# Altium schematic sheet DACs.SchDoc
size A; SheetNumber: 3; SheetTotal: 9
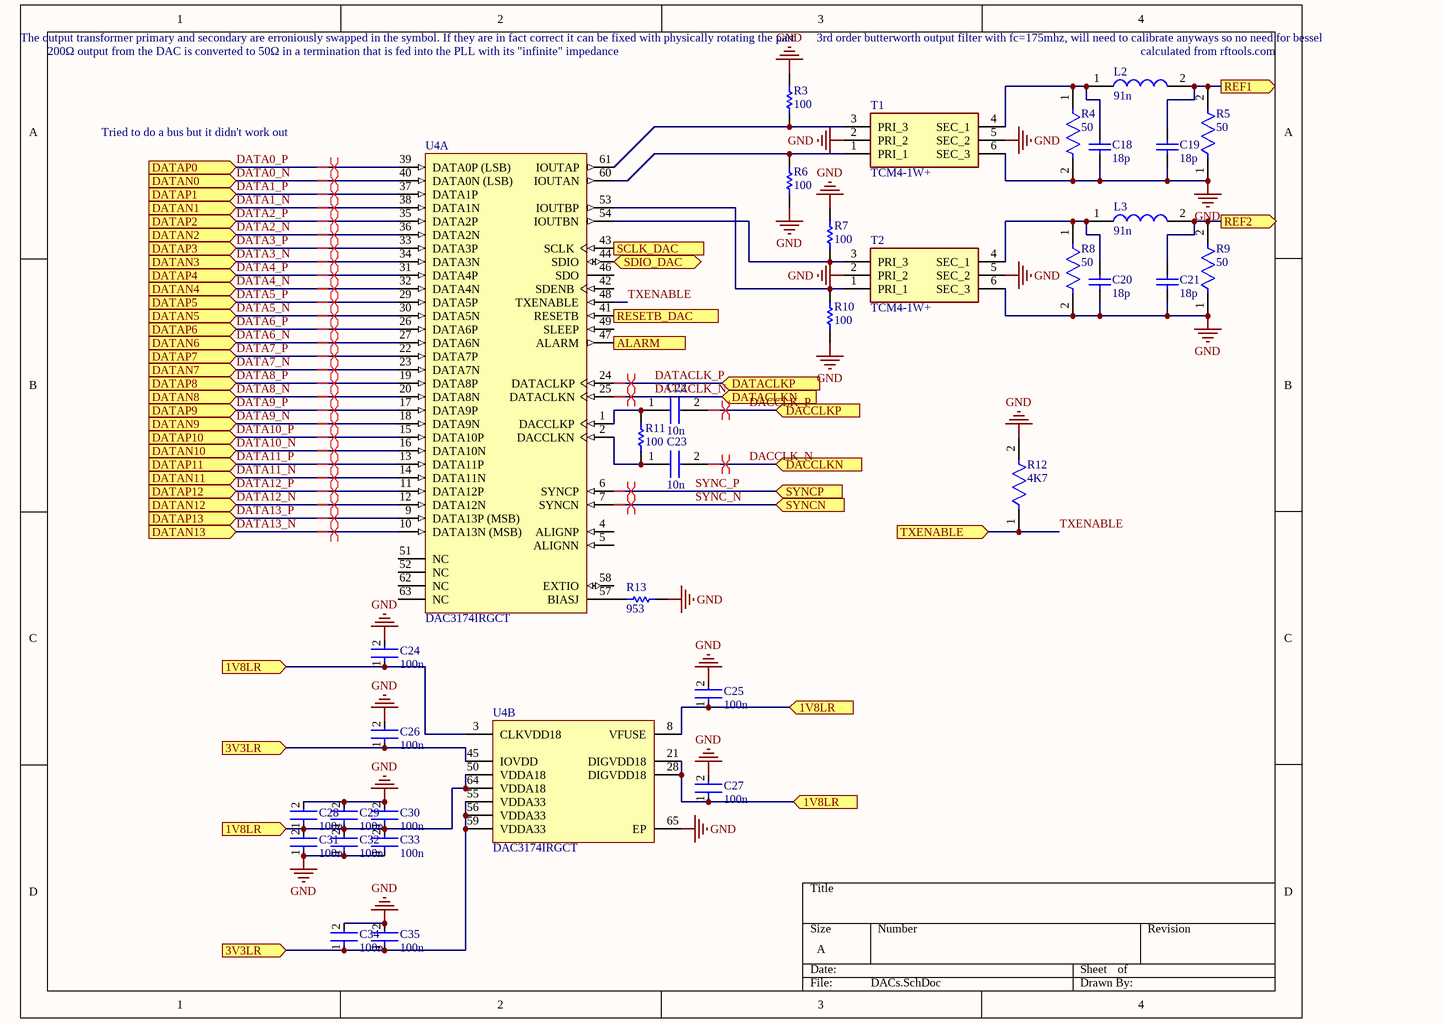
[diagram p0: DACs.SchDoc]

## Parts
C18  18p  [CAPC1006X50X20LL10T10]
C19  18p  [CAPC1006X50X20LL10T10]
C20  18p  [CAPC1006X50X20LL10T10]
C21  18p  [CAPC1006X50X20LL10T10]
C22  10n  [CAPC1005X61N]
C23  10n  [CAPC1005X61N]
C24  100n  [FP-GRM155-0_05-IPC_C]
C25  100n  [FP-GRM155-0_05-IPC_C]
C26  100n  [FP-GRM155-0_05-IPC_C]
C27  100n  [FP-GRM155-0_05-IPC_C]
C28  100n  [FP-GRM155-0_05-IPC_C]
C29  100n  [FP-GRM155-0_05-IPC_C]
C30  100n  [FP-GRM155-0_05-IPC_C]
C31  100n  [FP-GRM155-0_05-IPC_C]
C32  100n  [FP-GRM155-0_05-IPC_C]
C33  100n  [FP-GRM155-0_05-IPC_C]
C34  100n  [FP-GRM155-0_05-IPC_C]
C35  100n  [FP-GRM155-0_05-IPC_C]
L2  91n  [INDC1006X65N]
L3  91n  [INDC1006X65N]
R3  100  [RESC1005X40X25LL05T05]
R4  50  [FP-RC0402-0_4-MFG]
R5  50  [FP-RC0402-0_4-MFG]
R6  100  [RESC1005X40X25LL05T05]
R7  100  [RESC1005X40X25LL05T05]
R8  50  [FP-RC0402-0_4-MFG]
R9  50  [FP-RC0402-0_4-MFG]
R10  100  [RESC1005X40X25LL05T05]
R11  100  [RESC1005X40X25LL05T05]
R12  4K7  [FP-RT0402-MFG]
R13  953  [RESC1005X40X25NL10T10]
T1  TCM4-1W+  [TCM41W]
T2  TCM4-1W+  [TCM41W]
U4  DAC3174IRGCT  [TI-RGC64-7400X7400TP_V]  (parts A,B of 2)

## Ports
1V8LR (in), 3V3LR (in), ALARM (out), DACCLKN (in), DACCLKP (in), DATACLKN (in), DATACLKP (in), DATAN0 (in), DATAN1 (in), DATAN2 (in), DATAN3 (in), DATAN4 (in), DATAN5 (in), DATAN6 (in), DATAN7 (in), DATAN8 (in), DATAN9 (in), DATAN10 (in), DATAN11 (in), DATAN12 (in), DATAN13 (in), DATAP0 (in), DATAP1 (in), DATAP2 (in), DATAP3 (in), DATAP4 (in), DATAP5 (in), DATAP6 (in), DATAP7 (in), DATAP8 (in), DATAP9 (in), DATAP10 (in), DATAP11 (in), DATAP12 (in), DATAP13 (in), REF1 (out), REF2 (out), RESETB_DAC (in), SCLK_DAC (in), SDIO_DAC (bidir), SYNCN (in), SYNCP (in), TXENABLE (in)

## Nets
GND: C18.1 C19.1 C20.1 C21.1 C24.2 C25.2 C26.2 C27.2 C28.2 C29.2 C30.2 C31.1 C32.1 C33.1 C34.2 C35.2 R3.2 R4.2 R5.1 R6.1 R7.2 R8.2 R9.1 R10.1 R12.2 R13.2 T1.2(PRI_2) T1.5(SEC_2) T1.6(SEC_3) T2.2(PRI_2) T2.5(SEC_2) T2.6(SEC_3) U4.65(EP)
1V8LR: C24.1 C25.1 C27.1 C28.1 C29.1 C30.1 C31.2 C32.2 C33.2 U4.3(CLKVDD18) U4.8(VFUSE) U4.21(DIGVDD18) U4.28(DIGVDD18) U4.50(VDDA18) U4.64(VDDA18) ; port 1V8LR
3V3LR: C26.1 C34.1 C35.1 U4.45(IOVDD) U4.55(VDDA33) U4.56(VDDA33) U4.59(VDDA33) ; port 3V3LR
ALARM: U4.47(ALARM) ; port ALARM
DACCLK_N: C23.2 ; port DACCLKN
DACCLK_P: C22.2 ; port DACCLKP
DATA0_N: U4.40(DATA0N_(LSB)) ; port DATAN0
DATA0_P: U4.39(DATA0P_(LSB)) ; port DATAP0
DATA1_N: U4.38(DATA1N) ; port DATAN1
DATA1_P: U4.37(DATA1P) ; port DATAP1
DATA2_N: U4.36(DATA2N) ; port DATAN2
DATA2_P: U4.35(DATA2P) ; port DATAP2
DATA3_N: U4.34(DATA3N) ; port DATAN3
DATA3_P: U4.33(DATA3P) ; port DATAP3
DATA4_N: U4.32(DATA4N) ; port DATAN4
DATA4_P: U4.31(DATA4P) ; port DATAP4
DATA5_N: U4.30(DATA5N) ; port DATAN5
DATA5_P: U4.29(DATA5P) ; port DATAP5
DATA6_N: U4.27(DATA6N) ; port DATAN6
DATA6_P: U4.26(DATA6P) ; port DATAP6
DATA7_N: U4.23(DATA7N) ; port DATAN7
DATA7_P: U4.22(DATA7P) ; port DATAP7
DATA8_N: U4.20(DATA8N) ; port DATAN8
DATA8_P: U4.19(DATA8P) ; port DATAP8
DATA9_N: U4.18(DATA9N) ; port DATAN9
DATA9_P: U4.17(DATA9P) ; port DATAP9
DATA10_N: U4.16(DATA10N) ; port DATAN10
DATA10_P: U4.15(DATA10P) ; port DATAP10
DATA11_N: U4.14(DATA11N) ; port DATAN11
DATA11_P: U4.13(DATA11P) ; port DATAP11
DATA12_N: U4.12(DATA12N) ; port DATAN12
DATA12_P: U4.11(DATA12P) ; port DATAP12
DATA13_N: U4.10(DATA13N_(MSB)) ; port DATAN13
DATA13_P: U4.9(DATA13P_(MSB)) ; port DATAP13
DATACLK_N: U4.25(DATACLKN) ; port DATACLKN
DATACLK_P: U4.24(DATACLKP) ; port DATACLKP
REF1: C19.2 L2.2 R5.2 ; port REF1
REF2: C21.2 L3.2 R9.2 ; port REF2
RESETB_DAC: U4.41(RESETB) ; port RESETB_DAC
SCLK_DAC: U4.43(SCLK) ; port SCLK_DAC
SDIO_DAC: U4.44(SDIO) ; port SDIO_DAC
SYNC_N: U4.7(SYNCN) ; port SYNCN
SYNC_P: U4.6(SYNCP) ; port SYNCP
TXENABLE: R12.1 U4.48(TXENABLE) ; port TXENABLE
NetC18_2: C18.2 L2.1 R4.1 T1.4(SEC_1)
NetC20_2: C20.2 L3.1 R8.1 T2.4(SEC_1)
NetC22_1: C22.1 R11.2 U4.1(DACCLKP)
NetC23_1: C23.1 R11.1 U4.2(DACCLKN)
NetR3_1: R3.1 T1.3(PRI_3) U4.61(IOUTAP)
NetR6_2: R6.2 T1.1(PRI_1) U4.60(IOUTAN)
NetR7_1: R7.1 T2.3(PRI_3) U4.54(IOUTBN)
NetR10_2: R10.2 T2.1(PRI_1) U4.53(IOUTBP)
NetR13_1: R13.1 U4.57(BIASJ)

Not connected (* = marked no-connect by the designer): U4 4(ALIGNP) 5(ALIGNN) 42(SDENB) 46(SDO) 49(SLEEP) 51(NC) 52(NC) 58(EXTIO) 62(NC) 63(NC)

## Layout directives
differential pair: DACCLK_N, DACCLK_P, DATA0_N, DATA0_P, DATA1_N, DATA1_P, DATA2_N, DATA2_P, DATA3_N, DATA3_P, DATA4_N, DATA4_P, DATA5_N, DATA5_P, DATA6_N, DATA6_P, DATA7_N, DATA7_P, DATA8_N, DATA8_P, DATA9_N, DATA9_P, DATA10_N, DATA10_P, DATA11_N, DATA11_P, DATA12_N, DATA12_P, DATA13_N, DATA13_P, DATACLK_N, DATACLK_P, SYNC_N, SYNC_P

## Notes on the sheet
- (near R3) The output transformer primary and secondary are erroniously swapped in the symbol. If they are in fact correct it can be fixed with physically rotating the part
- (near R3) 200Ω output from the DAC is converted to 50Ω in a termination that is fed into the PLL with its "infinite" impedance
- 3rd order butterworth output filter with fc=175mhz, will need to calibrate anyways so no need for bessel
- (near L2) calculated from rftools.com
- Tried to do a bus but it didn't work out

## Library data of the parts
C18-C21 = CMP-2008-04828-1: Manufacturer: AVX Interconnect / Elco; Part Number: 04023K180FBSTR
C22 C23 = 520L103KT16T: Capacitor; Manufacturer_Name: ATC / Kyocera AVX; Datasheet Link: https://rfs.kyocera-avx.com/userFiles/uploads/pdfs/520l.pdf; Height: 0.61mm; Manufacturer_Part_Number: 520L103KT16T; Mouser Part Number: 581-520L103KT16T; Mouser Price/Stock: https://www.mouser.co.uk/ProductDetail/ATC-KYOCERA-AVX/520L103KT16T?qs=1tb21EFCQjo0F0Wws%2FObWA%3D%3D
C24-C35 = CMP-06035-008289-1: Chip Multilayer Ceramic Capacitors for General Purpose, 0402, 0.10uF, X5R, 15%, 10%, 100V; Capacitance: 100nF; Case Code (Metric): 1005; Width: 0.5mm; Case/Package: 0402; Case Code (Imperial): 0402; Voltage Rating (DC): 100V; Package Quantity: 10000; Length: 0.039inch; Height: 0.5mm; Max Operating Temperature: 85°C; Lead Free: Lead Free; Termination: SMD/SMT; Mount: Surface Mount; Tolerance: 10%; Packaging: Tape and Reel; Voltage Rating: 100V; Thickness: 0.022inch; Dielectric: X5R; REACH SVHC: No SVHC; Min Operating Temperature: -55°C; Weight: 0.000212oz
L2 L3 = MLJ1005HXG91NJTD0B: Inductor; Manufacturer_Name: TDK; Datasheet Link: https://product.tdk.com/system/files/dam/doc/product/inductor/inductor/smd/catalog/inductor_commercial_standard_mlj1005h_en.pdf; Height: 0.65mm; Manufacturer_Part_Number: MLJ1005HXG91NJTD0B; Mouser Part Number: 810-MLJ1005HXG91NJTD; Mouser Price/Stock: https://www.mouser.co.uk/ProductDetail/TDK/MLJ1005HXG91NJTD0B?qs=TEkyp6rseslSN03swWUATw%3D%3D
R3 R6 R7 R10 R11 = CMP-2002-00605-3: Chip Resistor, 100 Ohm, +/- 1%, 100 mW, -55 to 155 degC, 0402 (1005 Metric), RoHS, Tape and Reel; Manufacturer: Basic Passives; PartNumber: ERJ-2RKF1000X; Power Rating: 100 mW; Resistance: 100 Ohm; Voltage Rating: 50 V; Case\/Package: 0402; Width: 0.5 mm; Pins: 2; ComponentLink2Description: Datasheet; PackageReference: 0402; Height: 0.35 mm; Tolerance: 1%; DatasheetVersion: 04/2015; Case Code (Imperial): 0402; Min Operating Temperature: -55 degC; Radiation Hardening: No; Length: 1 mm; Package Quantity: 10000; PackageDescription: 2-Pin Surface Mount Device, Body 1 x 0.5 mm; Mounting Technology: Surface Mount; Case Code (Metric): 1005; Packaging: Tape and Reel; ComponentLink1URL: http://www.panasonic.com/; RoHSCompliant: true; Max Operating Temperature: 155 degC; REACH SVHC: Yes; ComponentLink1Description: Manufacturer URL; ComponentLink2URL: http://industrial.panasonic.com/cdbs/www-data/pdf/RDA0000/AOA0000C86.pdf; Mount: Surface Mount
R4 R5 R8 R9 = CMP-00621-24490980-1: RC0402JR-0750RL SMD Chip Resistor, 50 Ohm, ± 5%, 63 mW, 0402 [1005 Metric], Thick Film, General Purpose; Temperature Coefficient: 100ppm/°C; Max Power Dissipation: 63mW; Resistance: 50Ω; Width: 508µm; RoHS: Compliant; Height: 406.4µm; Length: 990.6µm; Features: Moisture Resistant; Tolerance: 5%; Lead Free: Lead Free; Case/Package: 0402; NexarPartId: 24490980; Min Operating Temperature: -55°C; Composition: Thick Film; Packaging: Tape & Reel (TR); Schedule B: 8533210045, 8533210045; Number of Terminations: 2; Max Operating Temperature: 155°C
R12 = CMP-2002-02901-2: RES 4.70K OHM 1/16W 1% SMD 0402; Manufacturer Part Number: RT0402FRE074K7L; Manufacturer: Yageo; Voltage Rating: 50V; Temperature Coefficient: 50 ppm/°C; Value: 4.7KΩ; Tolerance: 0.01; Power Rating: 0.063W; ComponentLink2URL: http://www.yageo.com/documents/recent/PYu-RT_1-to-0.01_RoHS_L_9.pdf; Temperature Range High: +155°C; Mouser Description: Res Thin Film 0402 4.7K Ohm 1% 1/16W ±50ppm/°C SMD Paper T/R; Temperature Range Low: -55°C; Device Class L1: Passive Components; Lead Free: Yes; Series: RT; Resistance: 4.7KΩ; Automotive: No; Package: RT0402; Composition: Thin Film; RoHS: TRUE; ComponentLink2Description: Datasheet; Octopart: https://octopart.com/rt0402fre074k7l-yageo-1371922; Footprint Url: http://www.yageo.com/exep/pages/download/literatures/PYu-R_Mount_10.pdf; Height: 0.35mm; Category: Res; Device Class L3: Chip SMD Resistors; Temperature: -55°C to +155°C; Digikey Description: RES 4.70K OHM 1/16W 1% SMD 0402; Device Class L2: Resistors; Ipc Land Pattern Name: RESC10050X30
R13 = CMP-2002-04560-1: Manufacturer: KOA Speer; Part Number: RK73H1ETTP9530F
T1 T2 = TCM4-1W+: Transformer; Manufacturer_Name: Mini-Circuits; Datasheet Link: https://www.google.com/url?sa=t&rct=j&q=&esrc=s&source=web&cd=&cad=rja&uact=8&ved=2ahUKEwjm_aG0-oz0AhXN4IUKHUrwB4sQFnoECAMQAQ&url=https%3A%2F%2Fwww.minicircuits.com%2Fpdfs%2FTCM4-1W%2B.pdf&usg=AOvVaw11XL23IYKjB1UFdAKYtPlM; Height: 4.06mm; Manufacturer_Part_Number: TCM4-1W+; Mouser Part Number: 139-TCM4-1W; Mouser Price/Stock: https://www.mouser.co.uk/ProductDetail/Mini-Circuits/TCM4-1W%2b?qs=xZ%2FP%252Ba9zWqbIpovo64xO5Q%3D%3D
U4 = CMP-0004-01406-1: Dual 14-Bit 500 MSPS Digital to Analog Converter, -40 to 85 degC, 64-pin QFN (RGC64), Green (RoHS & no Sb/Br); Manufacturer: Texas Instruments; Power Consumption(Typ)(mW): 464; Resolution(Bits): 14; Settling Time(us): 0.011; SubFamily: High Speed DAC (>10MSPS); Packing: SMALL T&R; DAC Channels: 2; SFDR(dB): 82; DatasheetVersion: SLAS837A; ComponentLink3Description: Package Specification; ComponentLink1Description: Manufacturer URL; PackageDescription: 64-Pin Plastic Quad Flatpack No-Lead, Body 9 x 9 mm, Pitch 0.5 mm; Mounting Technology: Surface Mount; ComponentLink2URL: http://www.ti.com/lit/ds/symlink/dac3174.pdf; PackageReference: RGC64-7400X7400TP; PartNumber: DAC3174IRGCT; ComponentLink3URL: http://www.ti.com/litv/pdf/mpqf125e; ComponentLink2Description: Datasheet; Eco-Plan: Green (RoHS & no Sb/Br); PackageVersion: 4204106/F, 11/2011; ComponentLink1URL: http://www.ti.com/